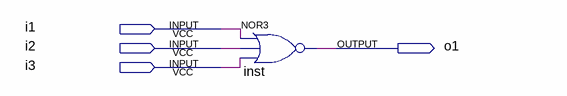
[diagram p0: schematic sheet]
// Quartus schematic nor_3.bdf as structural Verilog: 1 symbols, 4 pins
module nor_3 (
  input  i1,
  input  i2,
  input  i3,
  output o1
);

  nor inst (o1, i1, i2, i3);
endmodule
